# EAGLE design v2-landshark-handheld-controller (EAGLE 6.6.0)
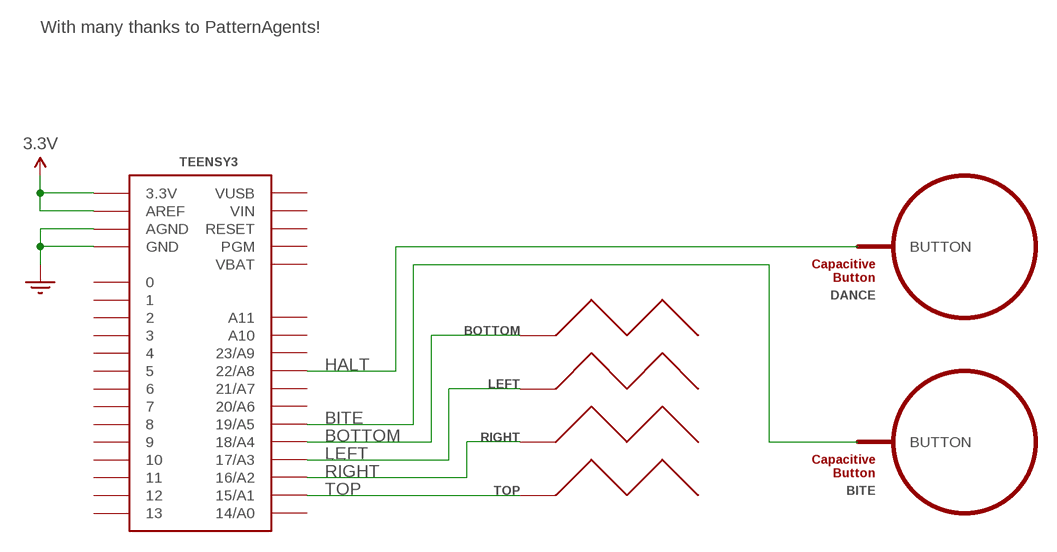
[diagram p0: schematic, sheet 1]

## Parts
BITE  BUTTON_PASSIVE12MM  [BUTTON_PASSIVE_12MM]
BOTTOM  SLIDER_PASSIVE_1SEG  [SLIDER_PASSIVE_1SEG_12MM]
DANCE  BUTTON_PASSIVE12MM  [BUTTON_PASSIVE_12MM]
LEFT  SLIDER_PASSIVE_1SEG  [SLIDER_PASSIVE_1SEG_12MM]
RIGHT  SLIDER_PASSIVE_1SEG  [SLIDER_PASSIVE_1SEG_12MM]
TEENSY3  TEENSY_3.0+4  [TEENSY_3.0+4]
TOP  SLIDER_PASSIVE_1SEG  [SLIDER_PASSIVE_1SEG_12MM]

## Nets
3.3V: TEENSY3.3.3V TEENSY3.3.3V1(3.3V) TEENSY3.AREF
BITE: BITE.BUTTON TEENSY3.19/A5
BOTTOM: BOTTOM.P$1(SL1) TEENSY3.18/A4
GND: TEENSY3.AGND TEENSY3.GND TEENSY3.GND1(GND)
HALT: DANCE.BUTTON TEENSY3.22/A8
LEFT: LEFT.P$1(SL1) TEENSY3.17/A3
RIGHT: RIGHT.P$1(SL1) TEENSY3.16/A2
TOP: TEENSY3.15/A1 TOP.P$1(SL1)
Unconnected: TEENSY3.0 TEENSY3.1 TEENSY3.2 TEENSY3.3 TEENSY3.4 TEENSY3.5 TEENSY3.6 TEENSY3.7 TEENSY3.8 TEENSY3.9 TEENSY3.10 TEENSY3.11 TEENSY3.12 TEENSY3.13 TEENSY3.14/A0 TEENSY3.20/A6 TEENSY3.21/A7 TEENSY3.23/A9 TEENSY3.A10 TEENSY3.A11 TEENSY3.PGM TEENSY3.RESET

## Notes on the sheet
- With many thanks to PatternAgents!

## Power pins joined to a net without a drawn wire
VBAT: TEENSY3.VBAT
VIN: TEENSY3.VIN
VUSB: TEENSY3.VUSB

## Library data of the parts
BITE DANCE = PatternAgents-TouchWidgets:BUTTON_PASSIVE: Button, Passive Capacitive/Touch Sensing Type Source : http://www.PatternAgents.com Github : https://github.com/PatternAgents License : http://creativecommons.org/licenses/by-sa/3.1/ (Creative Commons 3.1) THIS SOFTWARE IS PROVIDED BY THE CONTRIBUTORS "AS IS" AND WITHOUT ANY EXPRESS OR IMPLIED WARRANTIES, INCLUDING, BUT NOT LIMITED TO, THE IMPLIED WARRANTIES OF MERCHANTABILITY AND FITNESS FOR A PARTICULAR PURPOSE ARE DISCLAIMED. IN NO EVENT SHALL THE COPYRIGHT OWNER OR CONTRIBUTORS BE LIABLE FOR ANY DIRECT, INDIRECT, INCIDENTAL, SPECIAL, EXEMPLARY, OR CONSEQUENTIAL DAMAGES (INCLUDING, BUT NOT LIMITED TO, PROCUREMENT OF SUBSTITUTE GOODS OR SERVICES; LOSS OF USE, DATA, OR PROFITS; OR BUSINESS INTERRUPTION) HOWEVER CAUSED AND ON ANY THEORY OF LIABILITY, WHETHER IN CONTRACT, STRICT LIABILITY, OR TORT (INCLUDING NEGLIGENCE OR OTHERWISE) ARISING IN ANY WAY OUT OF THE USE OF THIS SOFTWARE, EVEN IF ADVISED OF THE POSSIBILITY OF SUCH DAMAGE.
BOTTOM LEFT RIGHT TOP = PatternAgents-TouchWidgets:SLIDER_PASSIVE_1SEG: Slider, Passive Touch/Capacitive Sensing Type, One (1) Segment Source : http://www.PatternAgents.com Github : https://github.com/PatternAgents License : http://creativecommons.org/licenses/by-sa/3.1/ (Creative Commons 3.1) THIS SOFTWARE IS PROVIDED BY THE CONTRIBUTORS "AS IS" AND WITHOUT ANY EXPRESS OR IMPLIED WARRANTIES, INCLUDING, BUT NOT LIMITED TO, THE IMPLIED WARRANTIES OF MERCHANTABILITY AND FITNESS FOR A PARTICULAR PURPOSE ARE DISCLAIMED. IN NO EVENT SHALL THE COPYRIGHT OWNER OR CONTRIBUTORS BE LIABLE FOR ANY DIRECT, INDIRECT, INCIDENTAL, SPECIAL, EXEMPLARY, OR CONSEQUENTIAL DAMAGES (INCLUDING, BUT NOT LIMITED TO, PROCUREMENT OF SUBSTITUTE GOODS OR SERVICES; LOSS OF USE, DATA, OR PROFITS; OR BUSINESS INTERRUPTION) HOWEVER CAUSED AND ON ANY THEORY OF LIABILITY, WHETHER IN CONTRACT, STRICT LIABILITY, OR TORT (INCLUDING NEGLIGENCE OR OTHERWISE) ARISING IN ANY WAY OUT OF THE USE OF THIS SOFTWARE, EVEN IF ADVISED OF THE POSSIBILITY OF SUCH DAMAGE.
TEENSY3 = Teensy3.0:TEENSY_3.0+4: Teensy 3.0 board, showing all pins that are easily acessible. See 'AllAnalogPins" and 'AllPins' packages for additional pin holes, as needed. The 'Basic' package has fewer pins.

## Board
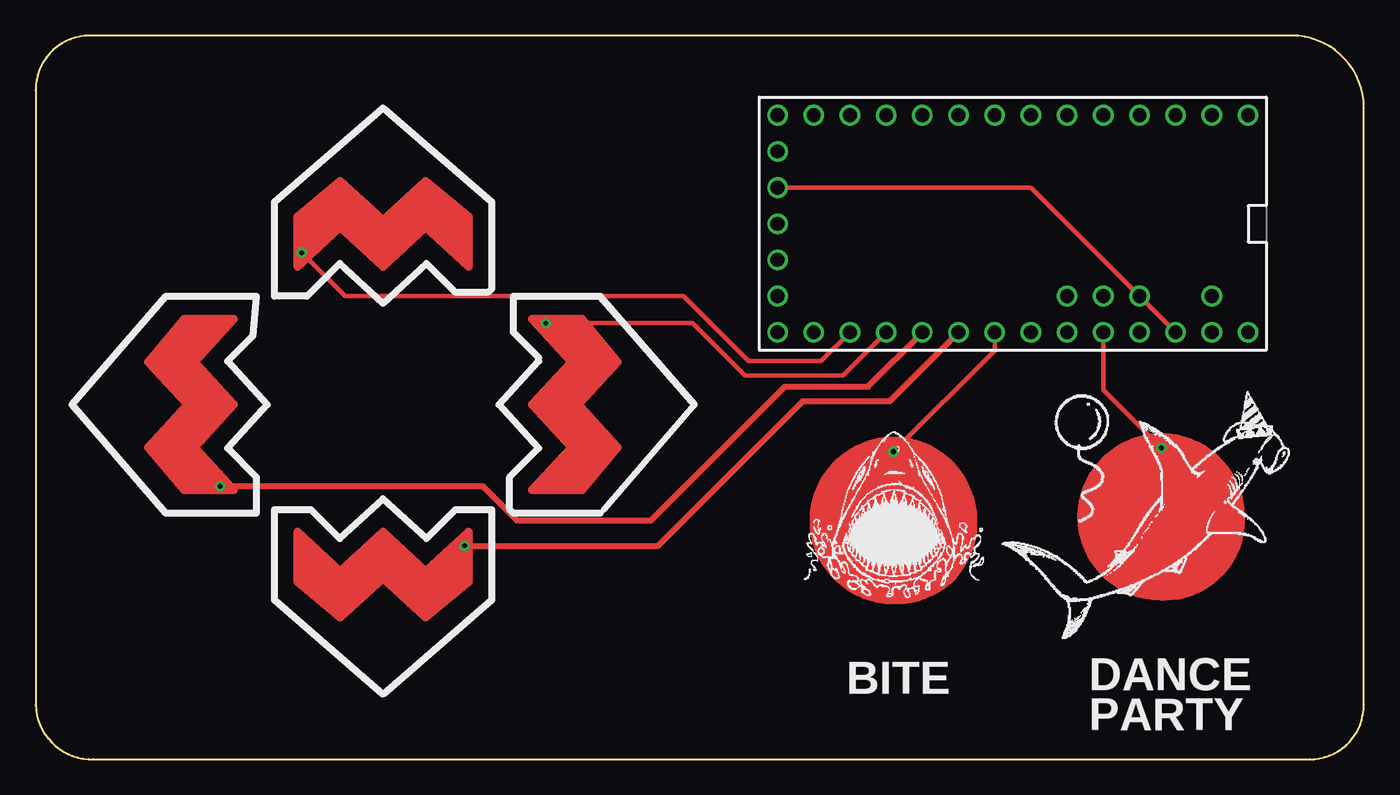
[diagram p1: board, top side]
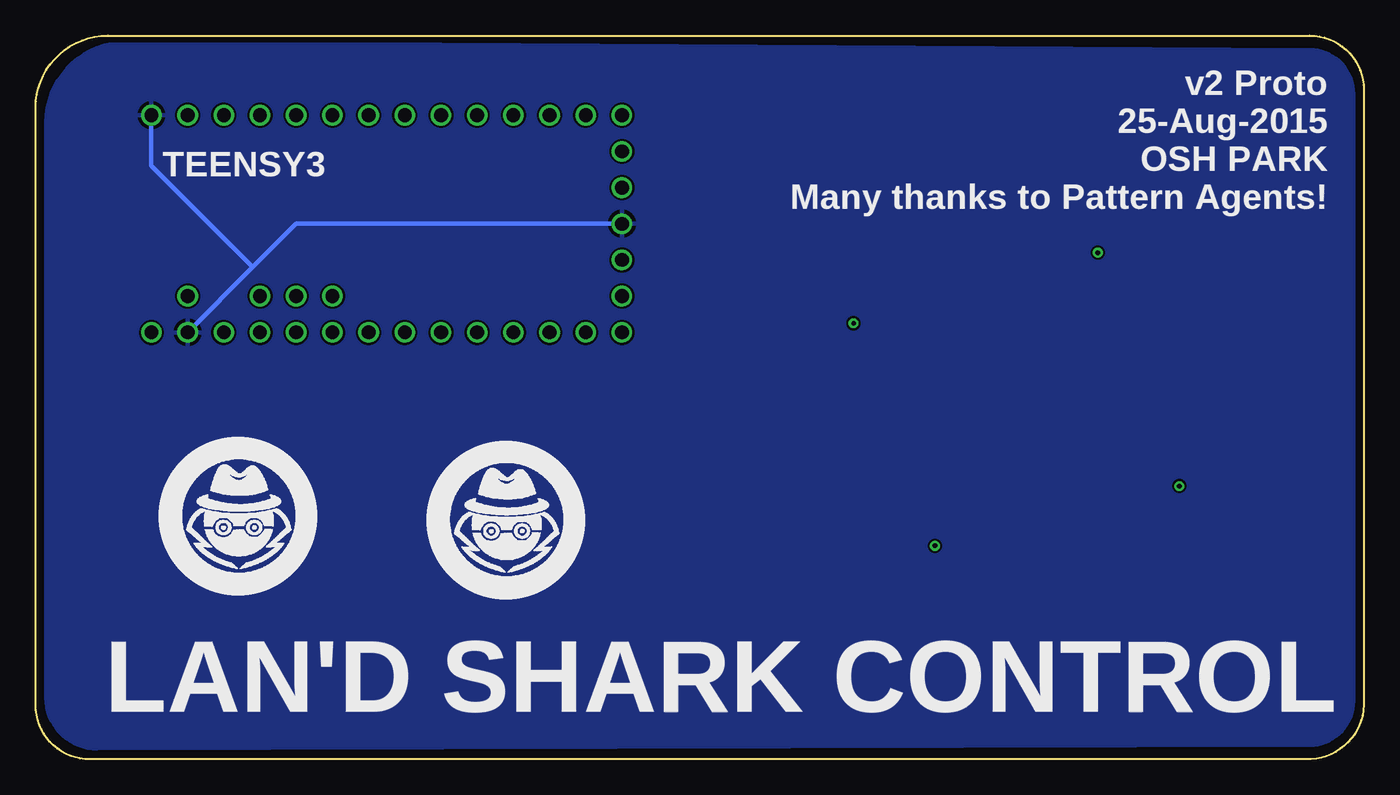
[diagram p2: board, bottom side, seen from below]

Size 93.22 x 50.8 mm. Coordinates in mm from the lower left corner, seen from the top.
Outline: 0,46.99 0,3.81 arc90 4.06,0 89.41,0 arc90 93.22,3.81 93.22,45.72 arc90 88.14,50.8 3.81,50.8 arc90 0,46.99
Copper layers (1*16): Top 0.0356mm / dielectric 1.5011mm / Bottom 0.0356mm
Design rules "LaenPCBOrder": minimum track width 6mil, minimum drill 13mil, track to track 6mil, track to pad 6mil, pad to pad 6mil, via to via 6mil, smd to smd 6mil, copper to edge 15mil, drill to drill 6mil, minimum pad ring 7mil, minimum via ring 7mil, stop-mask expansion 3mil, vias tented up to drill 0mil, thermal gap 10mil

### Footprints (pad centres in the part's own frame; a part is rotated, then mirrored left to right if it is on the bottom)
BUTTON_PASSIVE_12MM_BITE = drill 0.356: BUTTON 0,4.826
SLIDER_PASSIVE_1SEG_12MM = drill 0.33: P$1 -5.715,-2.54
BUTTON_PASSIVE_12MM_DANCE = drill 0.356: BUTTON 0,4.826
TEENSY_3.0+4 = drill 0.965: 0 -7.62,13.97; 1 -7.62,11.43; 2 -7.62,8.89; 3 -7.62,6.35; 3.3V 7.62,11.43; 3.3V1 -2.54,-16.51; 4 -7.62,3.81; 5 -7.62,1.27; 6 -7.62,-1.27; 7 -7.62,-3.81; 8 -7.62,-6.35; 9 -7.62,-8.89; 10 -7.62,-11.43; 11 -7.62,-13.97; 12 -7.62,-16.51; 13 7.62,-16.51; 14/A0 7.62,-13.97; 15/A1 7.62,-11.43; 16/A2 7.62,-8.89; 17/A3 7.62,-6.35; 18/A4 7.62,-3.81; 19/A5 7.62,-1.27; 20/A6 7.62,1.27; 21/A7 7.62,3.81; 22/A8 7.62,6.35; 23/A9 7.62,8.89; A10 5.08,6.35; A11 5.08,3.81; AGND 7.62,13.97; AREF 5.08,8.89; GND -7.62,16.51; GND1 0,-16.51; PGM 2.54,-16.51; RESET 5.08,-16.51; VBAT -5.08,-16.51; VIN 7.62,16.51; VUSB 5.08,13.97

### Placement (x,y rotation side)
BITE  [BUTTON_PASSIVE_12MM_BITE]  60.2,16.76 0 top
BOTTOM  24.38,12.45 180 top
DANCE  [BUTTON_PASSIVE_12MM_DANCE]  78.99,17.02 0 top
LEFT  10.41,24.89 90 top
RIGHT  38.35,24.89 270 top
TEENSY3  68.58,37.59 270 top
TOP  24.38,38.1 0 top

### Tracks (layer width: path | path; a pad name or v marks a point on that pad's centre or on a via)
3.3V
  Top 0.33: TEENSY3.3.3V1 69.85,40.13 TEENSY3.AREF TEENSY3.3.3V
BITE
  Top 0.33: TEENSY3.19/A5 67.31,28.7 BITE.BUTTON
BOTTOM
  Top 0.406: BOTTOM.P$1 43.69,14.99 53.85,25.15 59.94,25.15 TEENSY3.18/A4
GND
  Bottom 0.33: TEENSY3.GND1 74.93,37.59 77.98,34.54 | 77.98,34.54 TEENSY3.AGND | TEENSY3.GND 85.09,41.66 77.98,34.54
  pour Bottom: 0.76,4.06 arc90 3.81,1.02 88.9,0.76 arc90 92.46,4.32 92.46,44.7 arc90 86.87,50.29 3.81,49.78 arc90 0.76,46.74
HALT
  Top 0.33: TEENSY3.22/A8 74.93,25.91 DANCE.BUTTON
LEFT
  Top 0.406: LEFT.P$1 31.37,19.18 33.78,16.76 43.18,16.76 52.58,26.16 58.42,26.16 TEENSY3.17/A3
RIGHT
  Top 0.33: RIGHT.P$1 46.1,30.61 49.78,26.92 56.64,26.92 TEENSY3.16/A2
TOP
  Top 0.33: TEENSY3.15/A1 55.12,27.94 50.04,27.94 45.47,32.51 21.72,32.51 TOP.P$1

### Text on the board
tPlace: PARTY
bPlace: v2 Proto / 25-Aug-2015 / OSH PARK / Many thanks to Pattern Agents! | LAN'D SHARK CONTROL